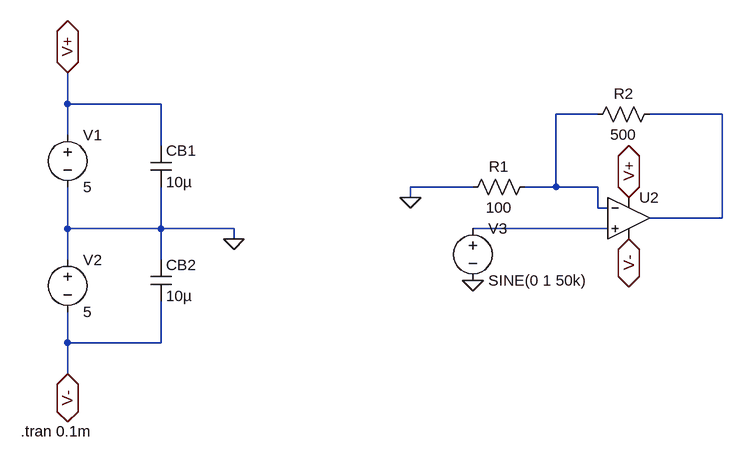
[diagram p0: schematic m_case4.asc]
m_case4.asc, the LTspice schematic file:
Version 4
SHEET 1 1172 680
WIRE 16 48 16 0
WIRE 160 48 16 48
WIRE 832 64 768 64
WIRE 1024 64 912 64
WIRE 16 96 16 48
WIRE 160 112 160 48
WIRE 640 176 544 176
WIRE 768 176 768 64
WIRE 768 176 720 176
WIRE 832 176 768 176
WIRE 544 192 544 176
WIRE 832 208 832 176
WIRE 848 208 832 208
WIRE 1024 224 1024 64
WIRE 1024 224 912 224
WIRE 16 240 16 176
WIRE 160 240 160 176
WIRE 160 240 16 240
WIRE 272 240 160 240
WIRE 848 240 640 240
WIRE 272 256 272 240
WIRE 16 288 16 240
WIRE 160 288 160 240
WIRE 16 416 16 368
WIRE 160 416 160 352
WIRE 160 416 16 416
WIRE 16 464 16 416
FLAG 272 256 0
FLAG 16 0 V+
IOPIN 16 0 BiDir
FLAG 16 464 V-
IOPIN 16 464 BiDir
FLAG 880 192 V+
IOPIN 880 192 BiDir
FLAG 880 256 V-
IOPIN 880 256 BiDir
FLAG 544 192 0
FLAG 640 320 0
SYMBOL voltage 16 80 R0
WINDOW 123 0 0 Left 0
WINDOW 39 0 0 Left 0
SYMATTR InstName V1
SYMATTR Value 5
SYMBOL voltage 16 272 R0
WINDOW 123 0 0 Left 0
WINDOW 39 0 0 Left 0
SYMATTR InstName V2
SYMATTR Value 5
SYMBOL cap 144 112 R0
SYMATTR InstName CB1
SYMATTR Value 10µ
SYMBOL cap 144 288 R0
SYMATTR InstName CB2
SYMATTR Value 10µ
SYMBOL res 736 160 R90
WINDOW 0 0 56 VBottom 2
WINDOW 3 32 56 VTop 2
SYMATTR InstName R1
SYMATTR Value 100
SYMBOL res 928 48 R90
WINDOW 0 0 56 VBottom 2
WINDOW 3 32 56 VTop 2
SYMATTR InstName R2
SYMATTR Value 500
SYMBOL voltage 640 224 R0
WINDOW 123 0 0 Left 0
WINDOW 39 0 0 Left 0
SYMATTR InstName V3
SYMATTR Value SINE(0 1 50k)
SYMBOL OpAmps\\UniversalOpAmp2 880 224 R0
SYMATTR InstName U2
TEXT -56 552 Left 2 !.tran 0.1m

The netlist it stands for:
* m_case4.asc
V1 V+ 0 5
V2 0 V- 5
CB1 V+ 0 10µ
CB2 0 V- 10µ
R1 N001 0 100
R2 N002 N001 500
V3 N003 0 SINE(0 1 50k)
XU2 N003 N001 V+ V- N002 level2 Avol=1Meg GBW=10Meg Slew=10Meg Ilimit=25m Rail=0 Vos=0 En=0 Enk=0 In=0 Ink=0 Rin=500Meg  ; pins In+ In- V+ V- OUT
.tran 0.1m
.lib UniversalOpAmp2.lib
.backanno
.end